# Altium schematic sheet D_Input.SchDoc
size A; SheetNumber: 4; SheetTotal: 9
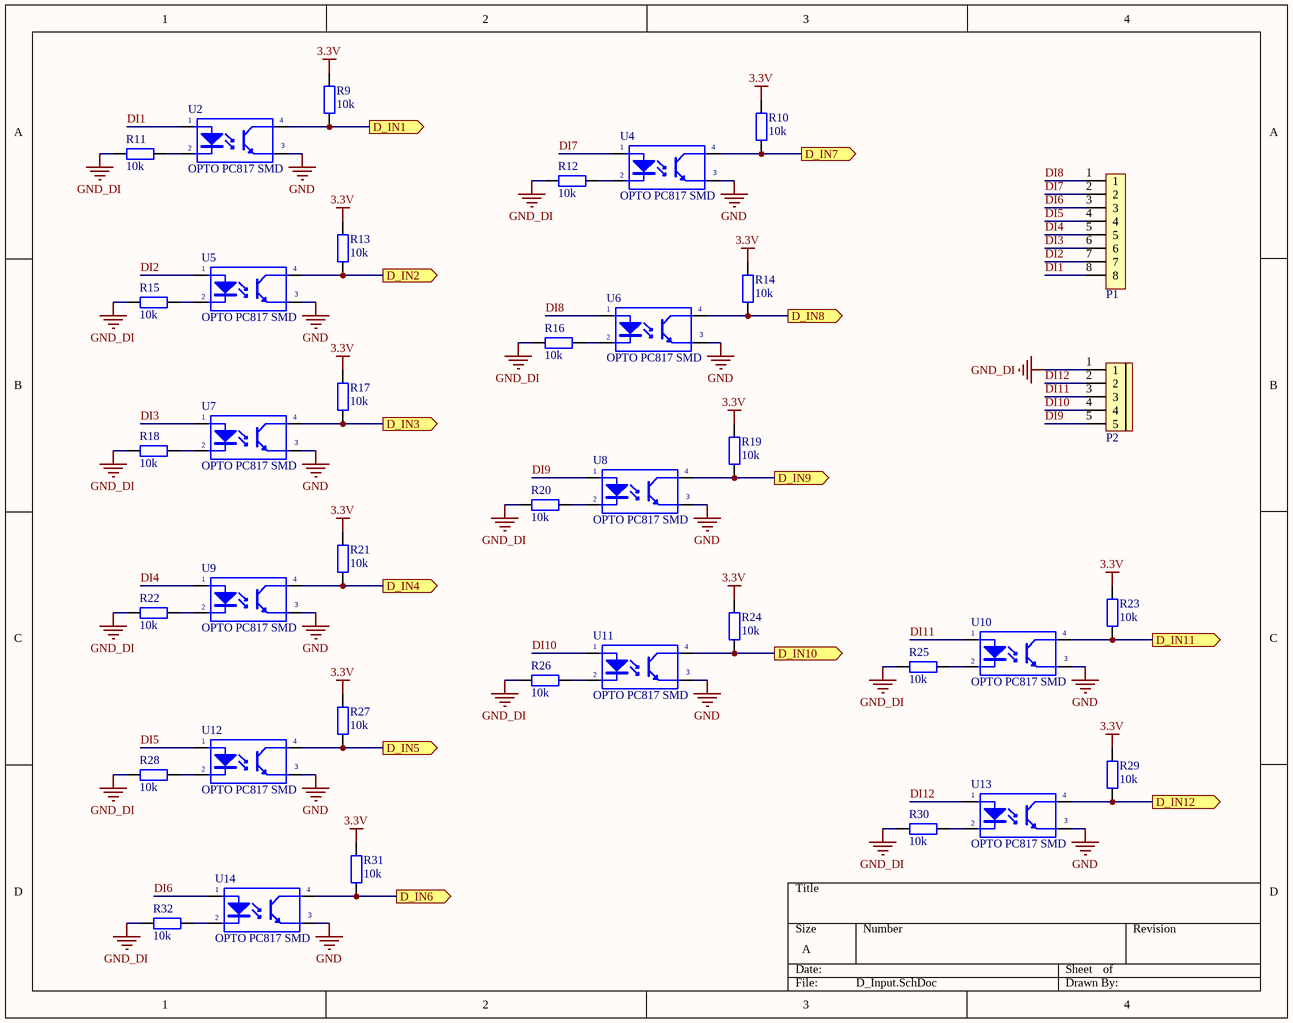
[diagram p0: D_Input.SchDoc]

## Parts
P1  CON 8 EDG5.08  [CON 8 8EDG5.08]  (value not drawn)
P2  CON 5 EDG5.08  [CON 5 5EDG5.08]  (value not drawn)
R9  10k  [tro smd 0805]
R10  10k  [tro smd 0805]
R11  10k  [tro smd 0805]
R12  10k  [tro smd 0805]
R13  10k  [tro smd 0805]
R14  10k  [tro smd 0805]
R15  10k  [tro smd 0805]
R16  10k  [tro smd 0805]
R17  10k  [tro smd 0805]
R18  10k  [tro smd 0805]
R19  10k  [tro smd 0805]
R20  10k  [tro smd 0805]
R21  10k  [tro smd 0805]
R22  10k  [tro smd 0805]
R23  10k  [tro smd 0805]
R24  10k  [tro smd 0805]
R25  10k  [tro smd 0805]
R26  10k  [tro smd 0805]
R27  10k  [tro smd 0805]
R28  10k  [tro smd 0805]
R29  10k  [tro smd 0805]
R30  10k  [tro smd 0805]
R31  10k  [tro smd 0805]
R32  10k  [tro smd 0805]
U2  OPTO PC817 SMD  [SOP4]
U4  OPTO PC817 SMD  [SOP4]
U5  OPTO PC817 SMD  [SOP4]
U6  OPTO PC817 SMD  [SOP4]
U7  OPTO PC817 SMD  [SOP4]
U8  OPTO PC817 SMD  [SOP4]
U9  OPTO PC817 SMD  [SOP4]
U10  OPTO PC817 SMD  [SOP4]
U11  OPTO PC817 SMD  [SOP4]
U12  OPTO PC817 SMD  [SOP4]
U13  OPTO PC817 SMD  [SOP4]
U14  OPTO PC817 SMD  [SOP4]

## Ports
D_IN1 (out), D_IN2 (out), D_IN3 (out), D_IN4 (out), D_IN5 (out), D_IN6 (out), D_IN7 (out), D_IN8 (out), D_IN9 (out), D_IN10 (out), D_IN11 (out), D_IN12 (out)

## Nets
3.3V: R9.2 R10.2 R13.2 R14.2 R17.2 R19.2 R21.2 R23.2 R24.2 R27.2 R29.2 R31.2
GND: U2.3(E) U4.3(E) U5.3(E) U6.3(E) U7.3(E) U8.3(E) U9.3(E) U10.3(E) U11.3(E) U12.3(E) U13.3(E) U14.3(E)
GND_DI: P2.1 R11.1 R12.1 R15.1 R16.1 R18.1 R20.1 R22.1 R25.1 R26.1 R28.1 R30.1 R32.1
D_IN1: R9.1 U2.4(C) ; port D_IN1
D_IN2: R13.1 U5.4(C) ; port D_IN2
D_IN3: R17.1 U7.4(C) ; port D_IN3
D_IN4: R21.1 U9.4(C) ; port D_IN4
D_IN5: R27.1 U12.4(C) ; port D_IN5
D_IN6: R31.1 U14.4(C) ; port D_IN6
D_IN7: R10.1 U4.4(C) ; port D_IN7
D_IN8: R14.1 U6.4(C) ; port D_IN8
D_IN9: R19.1 U8.4(C) ; port D_IN9
D_IN10: R24.1 U11.4(C) ; port D_IN10
D_IN11: R23.1 U10.4(C) ; port D_IN11
D_IN12: R29.1 U13.4(C) ; port D_IN12
DI1: P1.8 U2.1(A)
DI2: P1.7 U5.1(A)
DI3: P1.6 U7.1(A)
DI4: P1.5 U9.1(A)
DI5: P1.4 U12.1(A)
DI6: P1.3 U14.1(A)
DI7: P1.2 U4.1(A)
DI8: P1.1 U6.1(A)
DI9: P2.5 U8.1(A)
DI10: P2.4 U11.1(A)
DI11: P2.3 U10.1(A)
DI12: P2.2 U13.1(A)
NetR11_2: R11.2 U2.2(K)
NetR12_2: R12.2 U4.2(K)
NetR15_2: R15.2 U5.2(K)
NetR16_2: R16.2 U6.2(K)
NetR18_2: R18.2 U7.2(K)
NetR20_2: R20.2 U8.2(K)
NetR22_2: R22.2 U9.2(K)
NetR25_2: R25.2 U10.2(K)
NetR26_2: R26.2 U11.2(K)
NetR28_2: R28.2 U12.2(K)
NetR30_2: R30.2 U13.2(K)
NetR32_2: R32.2 U14.2(K)

## Library data of the parts
P1 = CON 8 EDG5.08: Cắm; Ten_Linh_Kien: CON 8 2EDG5.08-8P 5.08MM ( Xanh Cong); Ma_Hang: MH000978; Don_Vi: Con; Ghi_Chu: *; Kieu_Chan: *; Chung_Loai: Cắm
P2 = CON 5 EDG5.08: Cắm; Ten_Linh_Kien: CON 5 2EDG5.08-5P 5.08MM ( Xanh Cong); Ma_Hang: MH003589; Kieu_Chan: *; Don_Vi: Con; Ghi_Chu: *; Chung_Loai: Cắm
R9-R32 = Tro 0805 1% 10k: Dán; Don_Vi: Con; So_Chan: 2; Ten_Linh_Kien: Trở 0805 1% 10k; Ma_Hang: MH005473; Chung_Loai: Dán; Kieu_Chan: *
U2 U4-U14 = OPTO PC817 SMD: Single Opto; Value: PC817